# EAGLE design I2C_Messenger_r2 (EAGLE 7.7.0)
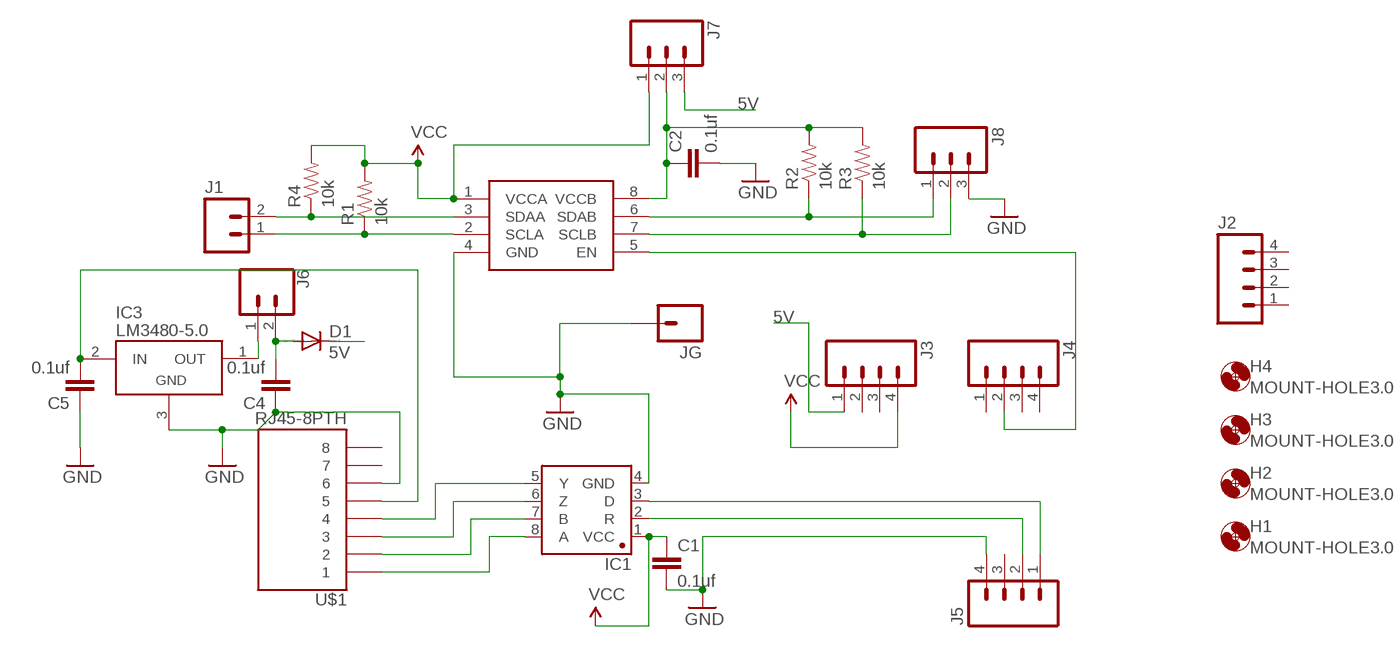
[diagram p0: schematic, sheet 1]

## Parts
C1  0.1uf  CAP1206  [1206]
C2  0.1uf  CAP1206  [1206]
C4  0.1uf  CAP1206  [1206]
C5  0.1uf  CAP1206  [1206]
D1  MBR0520LT  [SOD123]
H1  MOUNT-HOLE3.0  [3,0]
H2  MOUNT-HOLE3.0  [3,0]
H3  MOUNT-HOLE3.0  [3,0]
H4  MOUNT-HOLE3.0  [3,0]
IC1  SN65HVD31DR  [SO08]
IC2  PCA9517  [SO-08]
IC3  LM3480-5.0  [SOT-23-3]
J1  M02PTH  [1X02@1]
J2  M04PTH  [1X04]
J3  M04PTH  [1X04]
J4  M04PTH  [1X04]
J5  M04PTH  [1X04]
J6  CONN_02  [1X02]
J7  M03PTH  [1X03]
J8  M03SCREW_LOCK  [SCREWTERMINAL-3.5MM-3_LOCK.007S]
JG  M01PTH  [1X01]
R1  10k  RESISTOR1206  [1206]
R2  10k  RESISTOR1206  [1206]
R3  10k  RESISTOR1206  [1206]
R4  10k  RESISTOR1206  [1206]
U$1  RJ45-8PTH  [RJ45-8]

## Nets
5V: D1.C J3.1 J7.3
GND: C1.2 C2.2 C4.1 C5.1 IC1.4(GND) IC2.4(GND) IC3.3(GND) J5.4 J8.3 JG.1 U$1.6
N$1: C4.2 D1.A J6.2
N$2: IC3.1(OUT) J6.1
N$4: IC1.3(D) J5.1
N$5: IC2.2(SCLA) J1.1 R1.1
N$6: IC1.2(R) J5.2
N$7: IC1.8(A) U$1.1
N$8: IC1.7(B) U$1.2
N$9: IC1.6(Z) U$1.3
N$10: IC1.5(Y) U$1.4
N$11: IC2.3(SDAA) J1.2 R4.1
N$12: C2.1 IC2.8(VCCB) J7.2 R2.2 R3.2
N$13: IC2.5(EN) J4.2
N$14: IC2.6(SDAB) J8.1 R2.1
N$15: IC2.7(SCLB) J8.2 R3.1
N$26: C5.2 IC3.2(IN) U$1.5
VCC: C1.1 IC1.1(VCC) IC2.1(VCCA) J3.4 J7.1 R1.2 R4.2
Unconnected: J2.1 J2.2 J2.3 J2.4 J3.2 J3.3 J4.1 J4.3 J4.4 J5.3 U$1.7 U$1.8

## Notes on the sheet
- 5V
- 5V
- 5V

## Library data of the parts
C1 C2 C4 C5 = SparkFun-Capacitors:CAP: Capacitor Standard 0603 ceramic capacitor, and 0.1" leaded capacitor.
D1 = diode:MBR0520LT: SCHOTTKY BARRIER RECTIFIER Source: http://onsemi.com .. MBR0520LT1-D.pdf
H1-H4 = holes:MOUNT-HOLE: MOUNTING HOLE with drill center marker
IC1 = Joshparts4:SN65HVD31DR: A placeholder for generic narrow & wide SOIC8 foorptints - used on the DIP adapter board.
IC2 = PCA9517:PCA9517
IC3 = regulators:LM3480-*: National Semiconductor LM3480 100 mA, SOT-23, quasi-LDO linear regulator
J1 = SparkFun-Connectors:M02: Standard 2-pin 0.1" header. Use with - straight break away headers ( PRT-00116) - right angle break away headers (PRT-00553) - swiss pins (PRT-00743) - machine pins (PRT-00117) - female headers (PRT-00115) Molex polarized connector foot print use with: PRT-08233 with associated crimp pins and housings. 2.54_SCREWTERM for use with PRT-10571. 3.5mm Screw Terminal footprints for PRT-08084 5mm Screw Terminal footprints for use with PRT-08432
J2-J5 = SparkFun-Connectors:M04: Header 4 Standard 4-pin 0.1" header. Use with straight break away headers (SKU : PRT-00116), right angle break away headers (PRT-00553), swiss pins (PRT-00743), machine pins (PRT-00117), and female headers (PRT-00115). Molex polarized connector foot print use with SKU : PRT-08231 with associated crimp pins and housings. 1MM SMD Version SKU: PRT-10208; PROD_ID: CONN-09696
J6 = SparkFun-Connectors:CONN_02: Multi connection point. Often used as Generic Header-pin footprint for 0.1 inch spaced/style header connections On any of the 0.1 inch spaced packages, you can populate with these: Break Away Headers - Straight <https://www.sparkfun.com/products/116> (PRT-00116) Break Away Male Headers - Right Angle <https://www.sparkfun.com/products/553> (PRT-00553) Female Headers <https://www.sparkfun.com/products/115> (PRT-00115) Break Away Headers - Machine Pin <https://www.sparkfun.com/products/117> (PRT-00117) Break Away Female Headers - Swiss Machine Pin <https://www.sparkfun.com/products/743> (PRT-00743) For SCREWTERMINALS and SPRING TERMINALS visit here: Screw Terimnals on SparkFun.com <https://www.sparkfun.com/search/results?term=Screw+Terminals> (5mm/3.5mm/2.54mm spacing) This device is also useful as a general connection point to wire up your design to another part of your project. Our various solder wires solder well into these plated through hole pads. Hook-Up Wire - Assortment (Stranded, 22 AWG) <https://www.sparkfun.com/products/11375> (PRT-11375) Hook-Up Wire - Assortment (Solid Core, 22 AWG) <https://www.sparkfun.com/products/11367> (PRT-11367) View the entire wire category on our website here <https://www.sparkfun.com/categories/141> Special notes: Molex polarized connector foot print use with: PRT-08233 with associated crimp pins and housings. 2.54_SCREWTERM for use with PRT-10571. 3.5mm Screw Terminal footprints for PRT-08084 5mm Screw Terminal footprints for use with PRT-08432
J7 = SparkFun-Connectors:M03: Header 3 Standard 3-pin 0.1" header. Use with straight break away headers (SKU : PRT-00116), right angle break away headers (PRT-00553), swiss pins (PRT-00743), machine pins (PRT-00117), and female headers (PRT-00115). Molex polarized connector foot print use with SKU : PRT-08232 with associated crimp pins and housings.
J8 = SparkFun-Connectors:M03: Header 3 Standard 3-pin 0.1" header. Use with straight break away headers (SKU : PRT-00116), right angle break away headers (PRT-00553), swiss pins (PRT-00743), machine pins (PRT-00117), and female headers (PRT-00115). Molex polarized connector foot print use with SKU : PRT-08232 with associated crimp pins and housings.; PROD_ID: CONN-08288
JG = SparkFun-Connectors:M01: Header 1 Standard 1-pin 0.1" header. Use with straight break away headers (SKU : PRT-00116), right angle break away headers (PRT-00553), swiss pins (PRT-00743), machine pins (PRT-00117), and female headers (PRT-00115). SMTSO-256-ET is a "flush mount" nut for a 4-40 screw. The older package used to be too tight, and did not allow it to sit properly thru the drill hit. The latest (0.165DIA) fits nice and snug.
R1-R4 = SparkFun-Resistors:RESISTOR: Resistor Basic schematic elements and footprints for 0603, 1206, and PTH resistors.
U$1 = SparkFun:RJ45-8: RJ45 Jack Simple RJ45, 8-pin connection - connector for common Cat5, Cat5e, and Cat6 Ethernet cables. Footprint not yet proven in production. Connector sku is PRT-00643; Breakout PCB sku is BOB-00716.

## Board
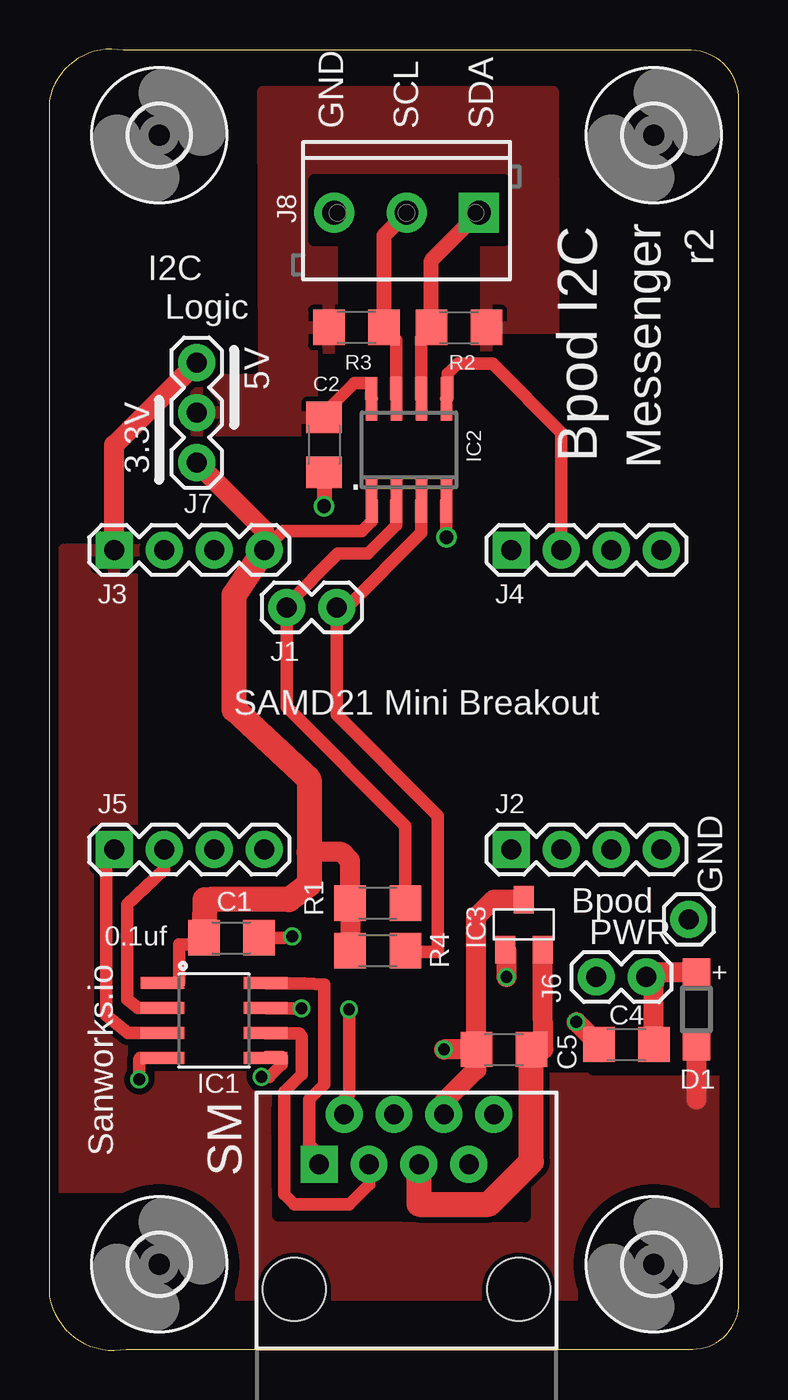
[diagram p1: board, top side]
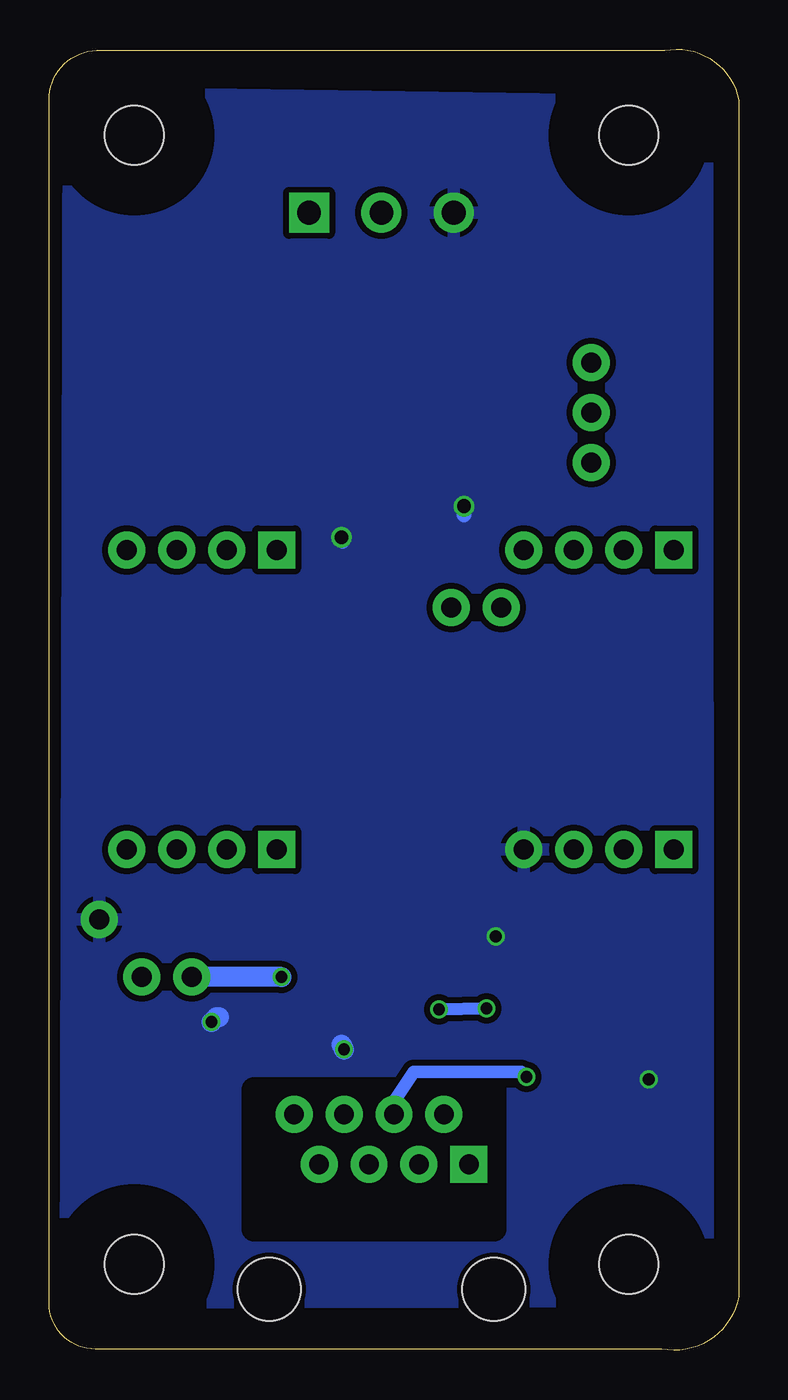
[diagram p2: board, bottom side, seen from below]

Size 35.05 x 66.16 mm. Coordinates in mm from the lower left corner, seen from the top.
Outline: 0,63.56 0,2.71 arc90 3.92,0.06 32.71,0.06 arc90 35.05,2.4 35.05,63.56 arc90 32.64,66.1 3.77,66.1 arc90 0,63.56
Copper layers (1*16): Top 0.035mm / dielectric 1.5mm / Bottom 0.035mm
Design rules "SeeedStudio_2layer_DRU_no_angle_20140221 *": minimum track width 6mil, minimum drill 12mil, track to track 12mil, track to pad 12mil, pad to pad 12mil, via to via 12mil, smd to smd 0mil, copper to edge 10mil, drill to drill 10mil, minimum pad ring 10mil, minimum via ring 6mil, stop-mask expansion 2mil, vias tented up to drill 100mil, thermal gap 10mil
tRestrict: area 15,23.9 to 33.8,41.2; area 5.8,14.3 to 27.5,23.6; area 14,46.3 to 16.5,50.4; area 15,50.9 to 16.5,53.4; area 20.1,50.9 to 21.6,56.4; area 23.1,47.8 to 26.2,51.4; area 11.6,6.8 to 24.2,12.3; area 27.7,14.3 to 34.3,23.4; area 4.8,25 to 11.4,40.2; area 13.5,56.4 to 23.1,59.5; area 15,53.9 to 16.5,55.9; area 0.8,2.6 to 5.8,7.7
bRestrict: area 12.4,6.2 to 24.6,13.3

### Footprints (pad centres in the part's own frame; a part is rotated, then mirrored left to right if it is on the bottom)
1206 = smd 1.6 x 1.8: 1 -1.4,0; 2 1.4,0
SOD123 = smd 1.4 x 1.4: A 1.9,0; C -1.9,0
3,0 = hole 3: 0,0
SO08 = smd 0.61 x 2.21: 1 -1.905,-2.616; 2 -0.635,-2.616; 3 0.635,-2.616; 4 1.905,-2.616; 5 1.905,2.616; 6 0.635,2.616; 7 -0.635,2.616; 8 -1.905,2.616
SO-08 = smd 0.6 x 2.2: 1 -1.905,-2.6; 2 -0.635,-2.6; 3 0.635,-2.6; 4 1.905,-2.6; 5 1.905,2.6; 6 0.635,2.6; 7 -0.635,2.6; 8 -1.905,2.6
SOT-23-3 = smd 1.016 x 1.397: 1 -0.953,-1.27; 2 0.953,-1.27; 3 0,1.27
1X02@1 = drill 1.016 pad 1.88: 1 0,0; 2 2.54,0
1X04 = drill 1.016 pad 1.88 square: 1 0,0 | drill 1.016 pad 1.88: 2 2.54,0; 3 5.08,0; 4 7.62,0
1X02 = drill 1.016 pad 1.88: 1 0,0; 2 2.54,0
1X03 = drill 1.016 pad 1.88: 1 0,0; 2 2.54,0; 3 5.08,0
SCREWTERMINAL-3.5MM-3_LOCK.007S = drill 1.2 pad 2.032 square: 1 -0.178,0 | drill 1.2 pad 2.032: 2 3.5,0; 3 7.178,0
1X01 = drill 1.016 pad 1.88: 1 0,0
RJ45-8 = drill 1 pad 1.88 square: 1 -4.445,6.35 | drill 1 pad 1.88: 2 -3.175,8.89; 3 -1.905,6.35; 4 -0.635,8.89; 5 0.635,6.35; 6 1.905,8.89; 7 3.175,6.35; 8 4.445,8.89 | hole 3.2: -5.715,0; 5.715,0

### Placement (x,y rotation side)
C1  9.27,20.97 0 top
C2  13.97,46.03 270 top
C4  29.34,15.55 0 top
C5  23.11,15.3 0 top
D1  32.89,17.33 90 top
H1  5.59,4.38 0 top
H2  30.73,4.38 0 top
H3  30.73,61.78 0 top
H4  5.59,61.78 0 top
IC1  8.38,16.77 270 top
IC2  18.29,45.78 0 top
IC3  24.13,21.65 0 top
J1  12.06,37.78 0 top
J2  23.5,25.46 0 top
J3  3.3,40.7 0 top
J4  23.5,40.7 0 top
J5  3.3,25.46 0 top
J6  27.81,18.98 0 top
J7  7.49,45.15 90 top
J8  21.67,57.85 180 top
JG  32.51,21.9 0 top
R1  16.7,22.73 180 top
R2  20.83,52 0 top
R3  15.62,52 180 top
R4  16.7,20.32 180 top
U$1  18.16,3.11 0 top

### Tracks (layer width: path | path; a pad name or v marks a point on that pad's centre or on a via)
5V
  Top 1.016: J3.1 3.3,46.03 J7.3 | D1.C 32.89,12.76
  pour Top: 0.76,40.7 0.76,2.85 33.78,2.85 33.78,40.7
GND  (via drill 0.6, 0.7)
  Top 0.635: C1.2 11.93,20.97 v12.36,21.05 | IC2.4 v20.19,41.34 | IC1.4 4.64,14.86 4.57,14.79 v4.57,13.78
  Top 0.762: C2.2 v13.97,42.92
  Top 1.016: C5.1 21.71,22.03 22.61,22.92 IC3.3 | C4.1 v26.8,16.69 v26.8,16.7 | C5.1 v20.07,15.3 | U$1.6 20.07,12.63 21.72,14.28 C5.1
  Bottom 0.635: v20.19,41.34 20.19,41.14 20.13,41.08
  Bottom 0.762: v13.97,42.92 13.97,42.48
  Bottom 1.016: v26.8,16.7 26.54,16.95 26.42,16.95 | v20.07,15.3 arc-3 20.19,15.55
  pour Bottom: 1.57,2.49 34.21,2.42 34.05,63.98 1.61,63.48
N$1
  Top 1.016: D1.A 30.86,19.24 30.86,18.98 J6.2 30.35,18.6 30.73,18.6 C4.2
N$2  (via drill 0.6)
  Top 1.016: IC3.1 23.24,20.32 v23.24,18.98
  Bottom 1.016: v23.24,18.98 J6.1
N$4
  Top 0.635: IC1.3 4,16.13 2.9,17.03 2.9,25.16 J5.1
N$5
  Top 0.635: IC2.2 17.65,41.97 16.19,40.51 14.67,40.51 12.06,37.91 J1.1 12.06,32.7 18.1,26.66 R1.1
N$6
  Top 0.635: IC1.2 4.5,17.4 3.96,17.84 3.96,22.67 5.84,24.44 J5.2
N$7
  Top 0.635: U$1.1 13.72,9.97 13.21,10.47 13.21,12.76 13.97,13.52 13.97,18.6 12.95,18.65 11.06,18.65 IC1.8
N$8  (via drill 0.6)
  Top 0.635: U$1.2 14.99,12.76 15.24,13.01 v15.24,17.33 | v12.83,17.38 11.06,17.38 IC1.7
  Bottom 0.635: v15.24,17.33 v12.83,17.38
N$9
  Top 0.635: U$1.3 16.26,8.44 15.24,7.43 12.45,7.43 11.94,7.93 11.94,13.14 12.83,14.03 12.83,15.94 12.7,16.11 11.01,16.11 IC1.6
N$10  (via drill 0.6)
  Top 0.635: v10.79,13.9 11.18,13.9 11.81,14.54 11.81,14.92 11.05,14.92 IC1.5
  Bottom 0.635: U$1.4 17.53,12.63 16.51,14.16 11.05,14.16 v10.79,13.9
N$11
  Top 0.635: J1.2 15.11,37.78 | 15.11,37.78 18.92,41.59 IC2.3 | R4.1 18.86,20.25 19.75,20.25 19.75,27.17 14.61,32.32 14.61,37.27 15.11,37.78
N$12
  Top 0.635: C2.1 13.97,47.66 15.49,49.18 16.36,49.18 16.36,48.41 IC2.8
  Top 1.016: 13.59,47.69 C2.1
  pour Top: 7.37,46.8 25.65,46.8 25.6,63.97 10.87,63.97 10.92,49.34 7.37,49.34
N$13
  Top 0.635: J4.2 26.04,46.67 22.54,50.16 20.76,50.16 20.26,49.65 20.26,48.44 IC2.5
N$14
  Top 0.635: IC2.6 18.92,51.5 R2.1
  Top 0.762: R2.1 19.43,55.43 J8.1
N$15
  Top 0.635: IC2.7 17.65,51.37 R3.1
  Top 0.762: R3.1 17.02,56.7 J8.2
N$26
  Top 1.016: C5.2 25.12,15.3 25.09,18.22 25.09,20.32 IC3.2
  Top 1.27: U$1.5 18.8,7.43 22.35,7.43 24.51,9.59 C5.2
VCC
  Top 0.635: IC1.1 6.6,18.67 6.6,20.63 7.87,20.63 C1.1 | IC2.1 16.38,42.16 15.88,41.65 11.87,41.65 J3.4
  Top 1.016: J3.4 10.92,41.72 J7.1 | 13.21,25.33 14.86,25.33 15.3,24.89 R1.2 R4.2
  Top 1.27: 7.93,22.92 7.92,22.68 | 7.92,22.68 C1.1 | J3.4 9.4,38.41 9.4,32.57 13.21,29.02 13.21,25.33 13.21,23.68 12.19,22.92 8.16,22.92 7.92,22.68

### Text on the board
tPlace: GND | SCL | SDA | Bpod I2C | Messenger | r2 | I2C | Logic | 5V | 3.3V | . | SAMD21 Mini Breakout | GND | Bpod | 0.1uf | PWR | Sanworks.io | + | SM